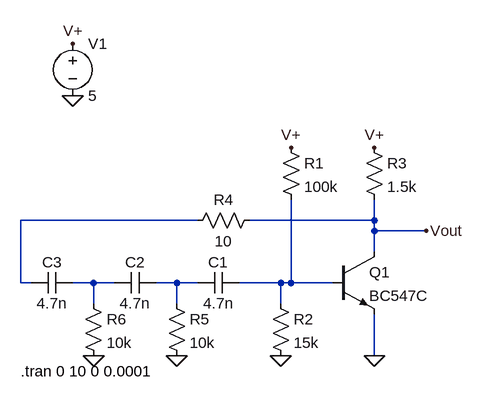
[diagram p0: schematic 06A-06.asc]
06A-06.asc, the LTspice schematic file:
Version 4.1
SHEET 1 880 680
WIRE 16 96 -256 96
WIRE 288 96 288 64
WIRE 288 96 96 96
WIRE 288 112 288 96
WIRE 368 112 288 112
WIRE 288 144 288 112
WIRE -256 192 -256 96
WIRE -240 192 -256 192
WIRE -144 192 -176 192
WIRE -112 192 -144 192
WIRE -16 192 -48 192
WIRE 16 192 -16 192
WIRE 144 192 80 192
WIRE 160 192 160 64
WIRE 160 192 144 192
WIRE 224 192 160 192
WIRE -144 224 -144 192
WIRE -16 224 -16 192
WIRE 144 224 144 192
WIRE 288 304 288 240
FLAG 144 304 0
FLAG -16 304 0
FLAG -144 304 0
FLAG 288 304 0
FLAG 288 -16 V+
FLAG 160 -16 V+
FLAG -176 -176 V+
FLAG -176 -96 0
FLAG 368 112 Vout
SYMBOL npn 224 144 R0
SYMATTR InstName Q1
SYMATTR Value BC547C
SYMBOL res 144 -32 R0
SYMATTR InstName R1
SYMATTR Value 100k
SYMBOL res 128 208 R0
SYMATTR InstName R2
SYMATTR Value 15k
SYMBOL res 272 -32 R0
SYMATTR InstName R3
SYMATTR Value 1.5k
SYMBOL res 112 80 R90
WINDOW 0 0 56 VBottom 2
WINDOW 3 32 56 VTop 2
SYMATTR InstName R4
SYMATTR Value 10
SYMBOL cap 80 176 R90
WINDOW 0 0 32 VBottom 2
WINDOW 3 32 32 VTop 2
SYMATTR InstName C1
SYMATTR Value 4.7n
SYMBOL cap -48 176 R90
WINDOW 0 0 32 VBottom 2
WINDOW 3 32 32 VTop 2
SYMATTR InstName C2
SYMATTR Value 4.7n
SYMBOL cap -176 176 R90
WINDOW 0 0 32 VBottom 2
WINDOW 3 32 32 VTop 2
SYMATTR InstName C3
SYMATTR Value 4.7n
SYMBOL res -32 208 R0
SYMATTR InstName R5
SYMATTR Value 10k
SYMBOL res -160 208 R0
SYMATTR InstName R6
SYMATTR Value 10k
SYMBOL voltage -176 -192 R0
WINDOW 123 0 0 Left 0
WINDOW 39 0 0 Left 0
SYMATTR InstName V1
SYMATTR Value 5
TEXT -256 328 Left 2 !.tran 0 10 0 0.0001

The netlist it stands for:
* 06A-06.asc
Q1 Vout N004 0 0 BC547C
R1 V+ N004 100k
R2 N004 0 15k
R3 V+ Vout 1.5k
R4 Vout N001 10
C1 N004 N003 4.7n
C2 N003 N002 4.7n
C3 N002 N001 4.7n
R5 N003 0 10k
R6 N002 0 10k
V1 V+ 0 5
.model NPN NPN
.model PNP PNP
.lib standard.bjt
.tran 0 10 0 0.0001
.backanno
.end